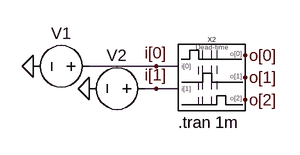
[diagram p0: schematic time-dead-time-gen-3way.asc]
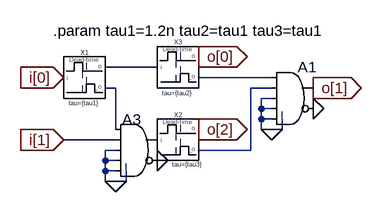
[diagram p1: sub-circuit dead-time-gen-3way.asc]
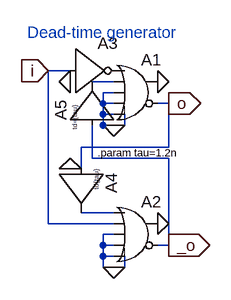
[diagram p2: sub-circuit dead-time-gen-fast.asc]
time-dead-time-gen-3way.asc, the LTspice schematic file:
Version 4
SHEET 1 880 680
WIRE 80 128 -16 128
WIRE 112 128 80 128
WIRE 80 160 64 160
WIRE 112 160 80 160
FLAG 208 112 o[0]
FLAG 208 144 o[1]
FLAG -96 128 0
FLAG 80 128 i[0]
FLAG 208 176 o[2]
FLAG -16 160 0
FLAG 80 160 i[1]
SYMBOL voltage 0 128 M270
WINDOW 0 32 56 VTop 2
WINDOW 3 -32 56 Invisible 2
WINDOW 123 0 0 Left 0
WINDOW 39 0 0 Left 0
SYMATTR InstName V1
SYMATTR Value PULSE(0 1 50n 1n 1n 50n 100n)
SYMBOL voltage 80 160 M270
WINDOW 0 32 56 VTop 2
WINDOW 3 -32 56 Invisible 2
WINDOW 123 0 0 Left 0
WINDOW 39 0 0 Left 0
SYMATTR InstName V2
SYMATTR Value PULSE(0 1 75n 1n 1n 75n 150n)
SYMBOL dead-time-gen-3way 160 144 R0
SYMATTR InstName X2
TEXT 112 208 Left 2 !.tran 1m

dead-time-gen-3way.asc, the sub-circuit schematic file:
Version 4
SHEET 1 880 964
WIRE -144 192 -224 192
WIRE 32 208 -80 208
WIRE -208 224 -224 224
WIRE 32 224 0 224
WIRE 32 240 16 240
WIRE 16 256 16 240
WIRE 32 256 16 256
WIRE 16 272 16 256
WIRE 32 272 16 272
WIRE -208 288 -208 224
WIRE 16 288 16 272
WIRE 32 288 16 288
WIRE 48 288 48 272
WIRE 48 288 32 288
WIRE -208 304 -288 304
WIRE -208 320 -224 320
WIRE 0 320 0 224
WIRE 0 320 -80 320
WIRE -224 336 -224 320
WIRE -208 336 -224 336
WIRE -224 352 -224 336
WIRE -208 352 -224 352
WIRE -224 368 -224 352
WIRE -208 368 -224 368
WIRE -192 368 -192 352
WIRE -192 368 -208 368
FLAG -288 208 i[0]
IOPIN -288 208 In
FLAG -288 304 i[1]
IOPIN -288 304 In
FLAG 96 256 0
FLAG 32 288 0
FLAG -144 336 0
FLAG -208 368 0
FLAG -80 176 o[0]
IOPIN -80 176 Out
FLAG 96 224 o[1]
IOPIN 96 224 Out
FLAG -80 288 o[2]
IOPIN -80 288 Out
SYMBOL Digital\\and 64 176 R0
SYMATTR InstName A1
SYMBOL Digital\\and -176 256 R0
WINDOW 0 -22 17 Left 2
SYMATTR InstName A3
SYMBOL dead-time-gen-fast -256 208 R0
WINDOW 39 -1 46 Bottom 0
SYMATTR SpiceLine tau={tau1}
SYMATTR InstName X1
SYMBOL dead-time-gen-fast -112 304 R0
WINDOW 39 14 44 Bottom 0
SYMATTR SpiceLine tau={tau3}
SYMATTR InstName X2
SYMBOL dead-time-gen-fast -112 192 R0
WINDOW 39 -1 46 Bottom 0
SYMATTR SpiceLine tau={tau2}
SYMATTR InstName X3
TEXT -304 136 Left 2 !.param tau1=1.2n tau2=tau1 tau3=tau1

dead-time-gen-fast.asc, the sub-circuit schematic file:
Version 4
SHEET 1 880 680
WIRE 112 16 80 16
WIRE 176 32 144 32
WIRE 176 48 160 48
WIRE 160 64 160 48
WIRE 176 64 160 64
WIRE 256 64 240 64
WIRE 160 80 160 64
WIRE 176 80 160 80
WIRE 160 96 160 80
WIRE 176 96 160 96
WIRE 192 96 192 80
WIRE 192 96 176 96
WIRE 256 128 256 64
WIRE 256 128 128 128
WIRE 144 144 144 96
WIRE 256 144 144 144
WIRE 128 160 128 128
WIRE 176 224 128 224
WIRE 80 240 80 16
WIRE 176 240 80 240
WIRE 176 256 160 256
WIRE 160 272 160 256
WIRE 176 272 160 272
WIRE 256 272 256 144
WIRE 256 272 240 272
WIRE 160 288 160 272
WIRE 176 288 160 288
WIRE 160 304 160 288
WIRE 176 304 160 304
WIRE 192 304 192 288
WIRE 192 304 176 304
FLAG 176 96 0
FLAG 176 304 0
FLAG 112 32 0
FLAG 256 64 o
IOPIN 256 64 Out
FLAG 256 272 _o
IOPIN 256 272 Out
FLAG 80 16 i
IOPIN 80 16 In
FLAG 112 160 0
FLAG 240 240 0
FLAG 240 32 0
SYMBOL Digital\\or 208 -16 R0
SYMATTR InstName A1
SYMBOL Digital\\inv 112 -48 R0
SYMATTR InstName A3
SYMBOL Digital\\or 208 192 R0
SYMATTR InstName A2
SYMBOL Digital\\buf1 192 160 R90
WINDOW 0 7 20 Left 2
WINDOW 3 1 41 Left 0
SYMATTR InstName A4
SYMATTR Value td{tau}
SYMBOL Digital\\buf1 80 96 R270
WINDOW 0 7 18 Left 2
WINDOW 3 -7 39 Left 0
SYMATTR InstName A5
SYMATTR Value td={tau}
TEXT 272 -40 Right 2 ;Dead-time generator
TEXT 152 136 Left 1 !.param tau=1.2n

The netlist it stands for:
* time-dead-time-gen-3way.asc
V1 i[0] 0 PULSE(0 1 50n 1n 1n 50n 100n)
V2 i[1] 0 PULSE(0 1 75n 1n 1n 75n 150n)
XX2 i[0] o[1] o[0] o[2] i[1] dead-time-gen-3way

* block symbol definitions
.subckt dead-time-gen-3way i[0] o[1] o[0] o[2] i[1]
A1 N002 N004 0 0 0 0 o[1] 0 AND
A3 N003 i[1] 0 0 0 0 P001 0 AND
XX1 i[0] N003 N001 dead-time-gen-fast params: tau={tau1}
XX2 P001 N004 o[2] dead-time-gen-fast params: tau={tau3}
XX3 N001 N002 o[0] dead-time-gen-fast params: tau={tau2}
.param tau1=1.2n tau2=tau1 tau3=tau1
.ends dead-time-gen-3way

.subckt dead-time-gen-fast i _o o
A1 P001 N001 0 0 0 o 0 0 OR
A3 i 0 0 0 0 P001 0 0 BUF
A2 N002 i 0 0 0 _o 0 0 OR
A4 o 0 0 0 0 0 N002 0 BUF td{tau}
A5 _o 0 0 0 0 0 N001 0 BUF td={tau}
* Dead-time generator
.param tau=1.2n
.ends dead-time-gen-fast

.tran 1m
.backanno
.end